# EAGLE design burnerman (EAGLE 9.6.0)
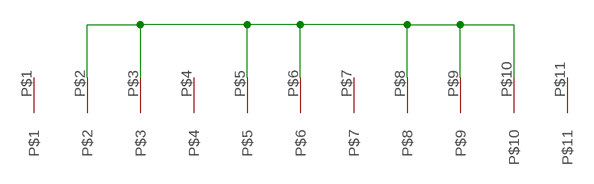
[diagram p0: schematic, sheet 1]

## Parts
U$1  ADVCHIP  [ADCHIP]

## Nets
N$4: U$1.P$2 U$1.P$3 U$1.P$5 U$1.P$6 U$1.P$8 U$1.P$9 U$1.P$10
Unconnected: U$1.P$1 U$1.P$4 U$1.P$7 U$1.P$11

## Library data of the parts
U$1 = advpins:ADVCHIP

## Board
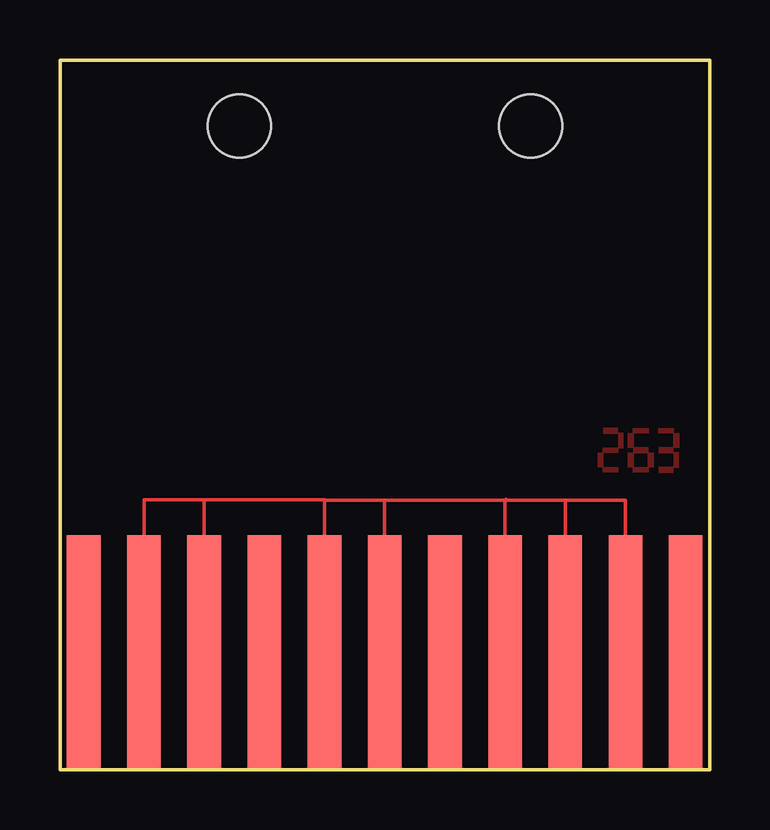
[diagram p1: board, top side]

Size 27.1 x 29.58 mm. Coordinates in mm from the lower left corner, seen from the top.
Outline: 0,29.58 0,0 27.1,0 27.1,29.58 0,29.58
Copper layers (1*16): Top 0.035mm / dielectric 1.5mm / Bottom 0.035mm
Design rules "default": minimum track width 6mil, minimum drill 0.35mm, track to track 6mil, track to pad 6mil, pad to pad 6mil, via to via 6mil, smd to smd 6mil, copper to edge 40mil, drill to drill 6mil, minimum pad ring 10mil, minimum via ring 8mil, stop-mask expansion 4mil, vias tented up to drill 0mil, thermal gap 10mil
Holes 2.62 mm at 7.48,26.83 19.62,26.83

### Footprints (pad centres in the part's own frame; a part is rotated, then mirrored left to right if it is on the bottom)
ADCHIP = smd 1.4 x 9.7: P$1 -27.61,5.02; P$2 -25.1,5.02; P$3 -22.59,5.02; P$4 -20.08,5.02; P$5 -17.57,5.02; P$6 -15.06,5.02; P$7 -12.55,5.02; P$8 -10.04,5.02; P$9 -7.53,5.02; P$10 -5.02,5.02; P$11 -2.51,5.02

### Placement (x,y rotation side)
U$1  28.6,-0.1 0 top

### Tracks (layer width: path | path; a pad name or v marks a point on that pad's centre or on a via)
N$1
  pour Top: 22.65,14.24 22.65,14.04 23.27,14.04 23.27,14.24
N$2
  pour Top: 23.28,14.04 23.28,13.42 23.48,13.42 23.48,14.04
N$3
  pour Top: 23.27,13.22 22.65,13.22 22.65,13.42 23.27,13.42
N$4
  Top 0.152: U$1.P$2 3.5,11.25 6.01,11.25 | 6.01,11.25 11.03,11.25 11.03,11.24 | 11.03,11.24 13.54,11.24 | 13.54,11.24 18.58,11.24 18.59,11.28 18.56,11.24 | 18.56,11.24 21.07,11.24 | 21.07,11.24 23.58,11.24 U$1.P$10 | U$1.P$3 6.01,11.25 | U$1.P$5 11.03,11.24 | U$1.P$6 13.54,11.24 | U$1.P$8 18.56,11.24 | U$1.P$9 21.07,11.24
N$5
  pour Top: 22.64,12.6 22.44,12.6 22.44,13.22 22.64,13.22
N$6
  pour Top: 23.27,12.4 22.65,12.4 22.65,12.6 23.27,12.6
N$7
  pour Top: 24.53,14.04 23.91,14.04 23.91,14.24 24.53,14.24
N$8
  pour Top: 23.9,13.42 23.7,13.42 23.7,14.04 23.9,14.04
N$9
  pour Top: 23.91,13.42 23.91,13.22 24.53,13.22 24.53,13.42
N$10
  pour Top: 23.9,12.6 23.7,12.6 23.7,13.22 23.9,13.22
N$11
  pour Top: 24.74,12.6 24.54,12.6 24.54,13.22 24.74,13.22
N$12
  pour Top: 24.53,12.4 23.91,12.4 23.91,12.6 24.53,12.6
N$13
  pour Top: 25.58,14.04 24.96,14.04 24.96,14.24 25.58,14.24
N$14
  pour Top: 25.79,13.42 25.59,13.42 25.59,14.04 25.79,14.04
N$15
  pour Top: 24.96,13.42 24.96,13.22 25.58,13.22 25.58,13.42
N$16
  pour Top: 25.59,13.22 25.59,12.6 25.79,12.6 25.79,13.22
N$17
  pour Top: 24.96,12.6 24.96,12.4 25.58,12.4 25.58,12.6